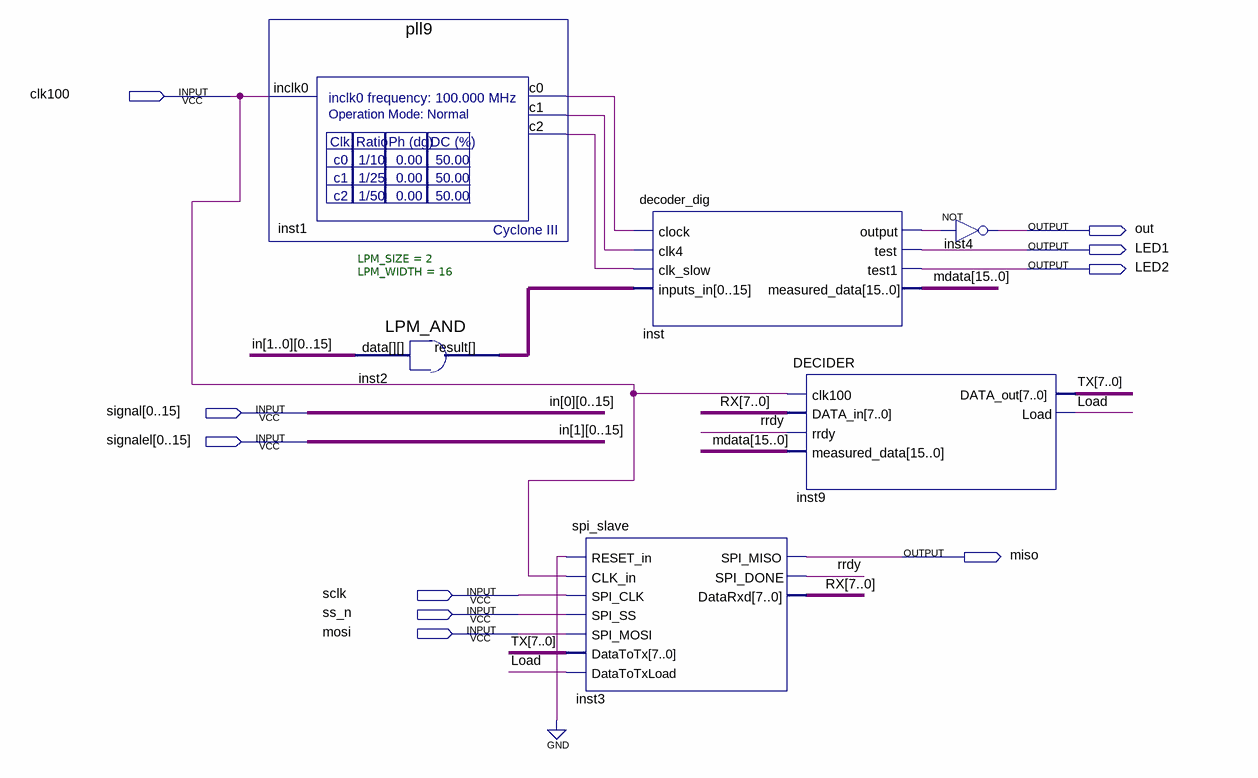
[diagram p0: schematic sheet]
// Quartus schematic main_part.bdf as structural Verilog: 6 symbols, 10 pins
module main_part (
  input  clk100,
  input  [0:15] signal,
  input  [0:15] signalel,
  input  sclk,
  input  ss_n,
  input  mosi,
  output out,
  output LED1,
  output LED2,
  output miso
);

  wire inst1_c0, inst1_c1, inst1_c2, inst_output, Load, rrdy;
  wire [7:0] RX, TX;
  wire [15:0] inst2_result, mdata;

  pll9 inst1 (.inclk0(clk100), .c0(inst1_c0), .c1(inst1_c1), .c2(inst1_c2));
  LPM_AND #(.LPM_SIZE(2), .LPM_WIDTH(16)) inst2 (.data({signalel, signal}), .result(inst2_result));
  spi_slave inst3 (
    .RESET_in(1'b0), .CLK_in(clk100), .SPI_CLK(sclk), .SPI_SS(ss_n), .SPI_MOSI(mosi), .DataToTx(TX),
    .DataToTxLoad(Load), .SPI_MISO(miso), .SPI_DONE(rrdy), .DataRxd(RX));
  decoder_dig inst (
    .clock(inst1_c0), .clk4(inst1_c1), .clk_slow(inst1_c2), .inputs_in(inst2_result), .\output (inst_output),
    .test(LED1), .test1(LED2), .measured_data(mdata));
  DECIDER inst9 (.clk100(clk100), .DATA_in(RX), .rrdy(rrdy), .measured_data(mdata), .DATA_out(TX), .Load(Load));
  not inst4 (out, inst_output);

  // Other names for the same wires on the sheet: in_0[15:0] = {signal[15], signal[14], signal[13], signal[12], signal[11], signal[10], signal[9], signal[8], signal[7], signal[6], signal[5], signal[4], signal[3], signal[2], signal[1], signal[0]};
  //   in_1[15:0] = {signalel[15], signalel[14], signalel[13], signalel[12], signalel[11], signalel[10], signalel[9], signalel[8], signalel[7], signalel[6], signalel[5], signalel[4], signalel[3], signalel[2], signalel[1], signalel[0]}
endmodule
